# EAGLE design mainv1 (EAGLE 6.5.0)
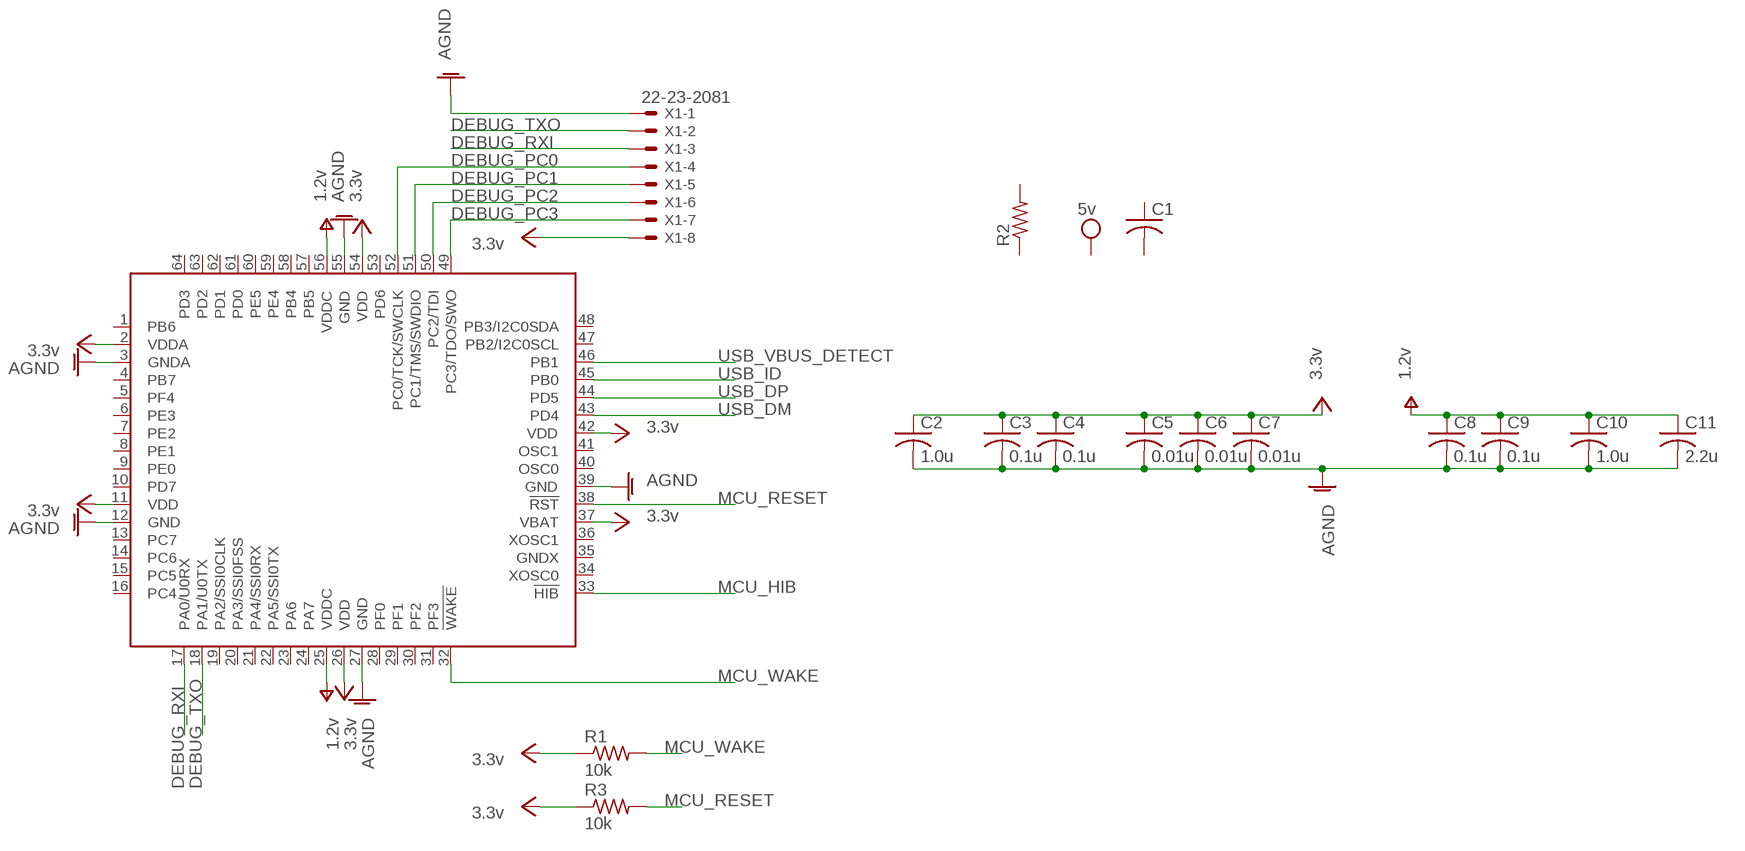
[diagram p0: schematic, sheet 1]

## Parts
C1  C-USC0805K  [C0805K]
C2  1.0u  C-USC0805K  [C0805K]
C3  0.1u  C-USC0805K  [C0805K]
C4  0.1u  C-USC0805K  [C0805K]
C5  0.01u  C-USC0805K  [C0805K]
C6  0.01u  C-USC0805K  [C0805K]
C7  0.01u  C-USC0805K  [C0805K]
C8  0.1u  C-USC0805K  [C0805K]
C9  0.1u  C-USC0805K  [C0805K]
C10  1.0u  C-USC0805K  [C0805K]
C11  2.2u  C-USC0805K  [C0805K]
IC1  TM4C123GH6PMI  [PM_S-PQFP-G64]
R1  10k  R-US_R0805  [R0805]
R2  R-US_R0805  [R0805]
R3  10k  R-US_R0805  [R0805]
X1  22-23-2081  [22-23-2081]

## Nets
AGND: C2.2 C3.2 C4.2 C5.2 C6.2 C7.2 C8.2 C9.2 C10.2 C11.2 IC1.3(GNDA) IC1.12(GND) IC1.27(GND) IC1.39(GND) IC1.55(GND) X1.1
DEBUG_PC0: IC1.52(PC0/TCK/SWCLK) X1.4
DEBUG_PC1: IC1.51(PC1/TMS/SWDIO) X1.5
DEBUG_PC2: IC1.50(PC2/TDI) X1.6
DEBUG_PC3: IC1.49(PC3/TDO/SWO) X1.7
DEBUG_RXI: IC1.17(PA0/U0RX) X1.3
DEBUG_TXO: IC1.18(PA1/U0TX) X1.2
MCU_HIB: IC1.33(!HIB)
MCU_RESET: IC1.38(!RST) R3.2
MCU_WAKE: IC1.32(!WAKE) R1.2
USB_DM: IC1.43(PD4)
USB_DP: IC1.44(PD5)
USB_ID: IC1.45(PB0)
USB_VBUS_DETECT: IC1.46(PB1)
V+: C8.1 C9.1 C10.1 C11.1 IC1.25(VDDC) IC1.56(VDDC) ; supply symbol labelled 1.2v
VCC: C2.1 C3.1 C4.1 C5.1 C6.1 C7.1 IC1.2(VDDA) IC1.11(VDD) IC1.26(VDD) IC1.37(VBAT) IC1.42(VDD) IC1.54(VDD) R1.1 R3.1 X1.8 ; supply symbol labelled 3.3v
Unconnected: C1.1 C1.2 IC1.1(PB6) IC1.4(PB7) IC1.5(PF4) IC1.6(PE3) IC1.7(PE2) IC1.8(PE1) IC1.9(PE0) IC1.10(PD7) IC1.13(PC7) IC1.14(PC6) IC1.15(PC5) IC1.16(PC4) IC1.19(PA2/SSI0CLK) IC1.20(PA3/SSI0FSS) IC1.21(PA4/SSI0RX) IC1.22(PA5/SSI0TX) IC1.23(PA6) IC1.24(PA7) IC1.28(PF0) IC1.29(PF1) IC1.30(PF2) IC1.31(PF3) IC1.34(XOSC0) IC1.35(GNDX) IC1.36(XOSC1) IC1.40(OSC0) IC1.41(OSC1) IC1.47(PB2/I2C0SCL) IC1.48(PB3/I2C0SDA) IC1.53(PD6) IC1.57(PB5) IC1.58(PB4) IC1.59(PE4) IC1.60(PE5) IC1.61(PD0) IC1.62(PD1) IC1.63(PD2) IC1.64(PD3) R2.1 R2.2

## Library data of the parts
C1-C11 = rcl:C-US: CAPACITOR, American symbol
IC1 = ti-tiva:TM4C123GH6PMI: by AtillaB
R1-R3 = rcl:R-US_: RESISTOR, American symbol
X1 = con-molex:22-23-2081: .100" (2.54mm) Center Header - 8 Pin; MF: MOLEX; MPN: 22-23-2081; OC_FARNELL: 1756826; OC_NEWARK: 01C7592

## Board
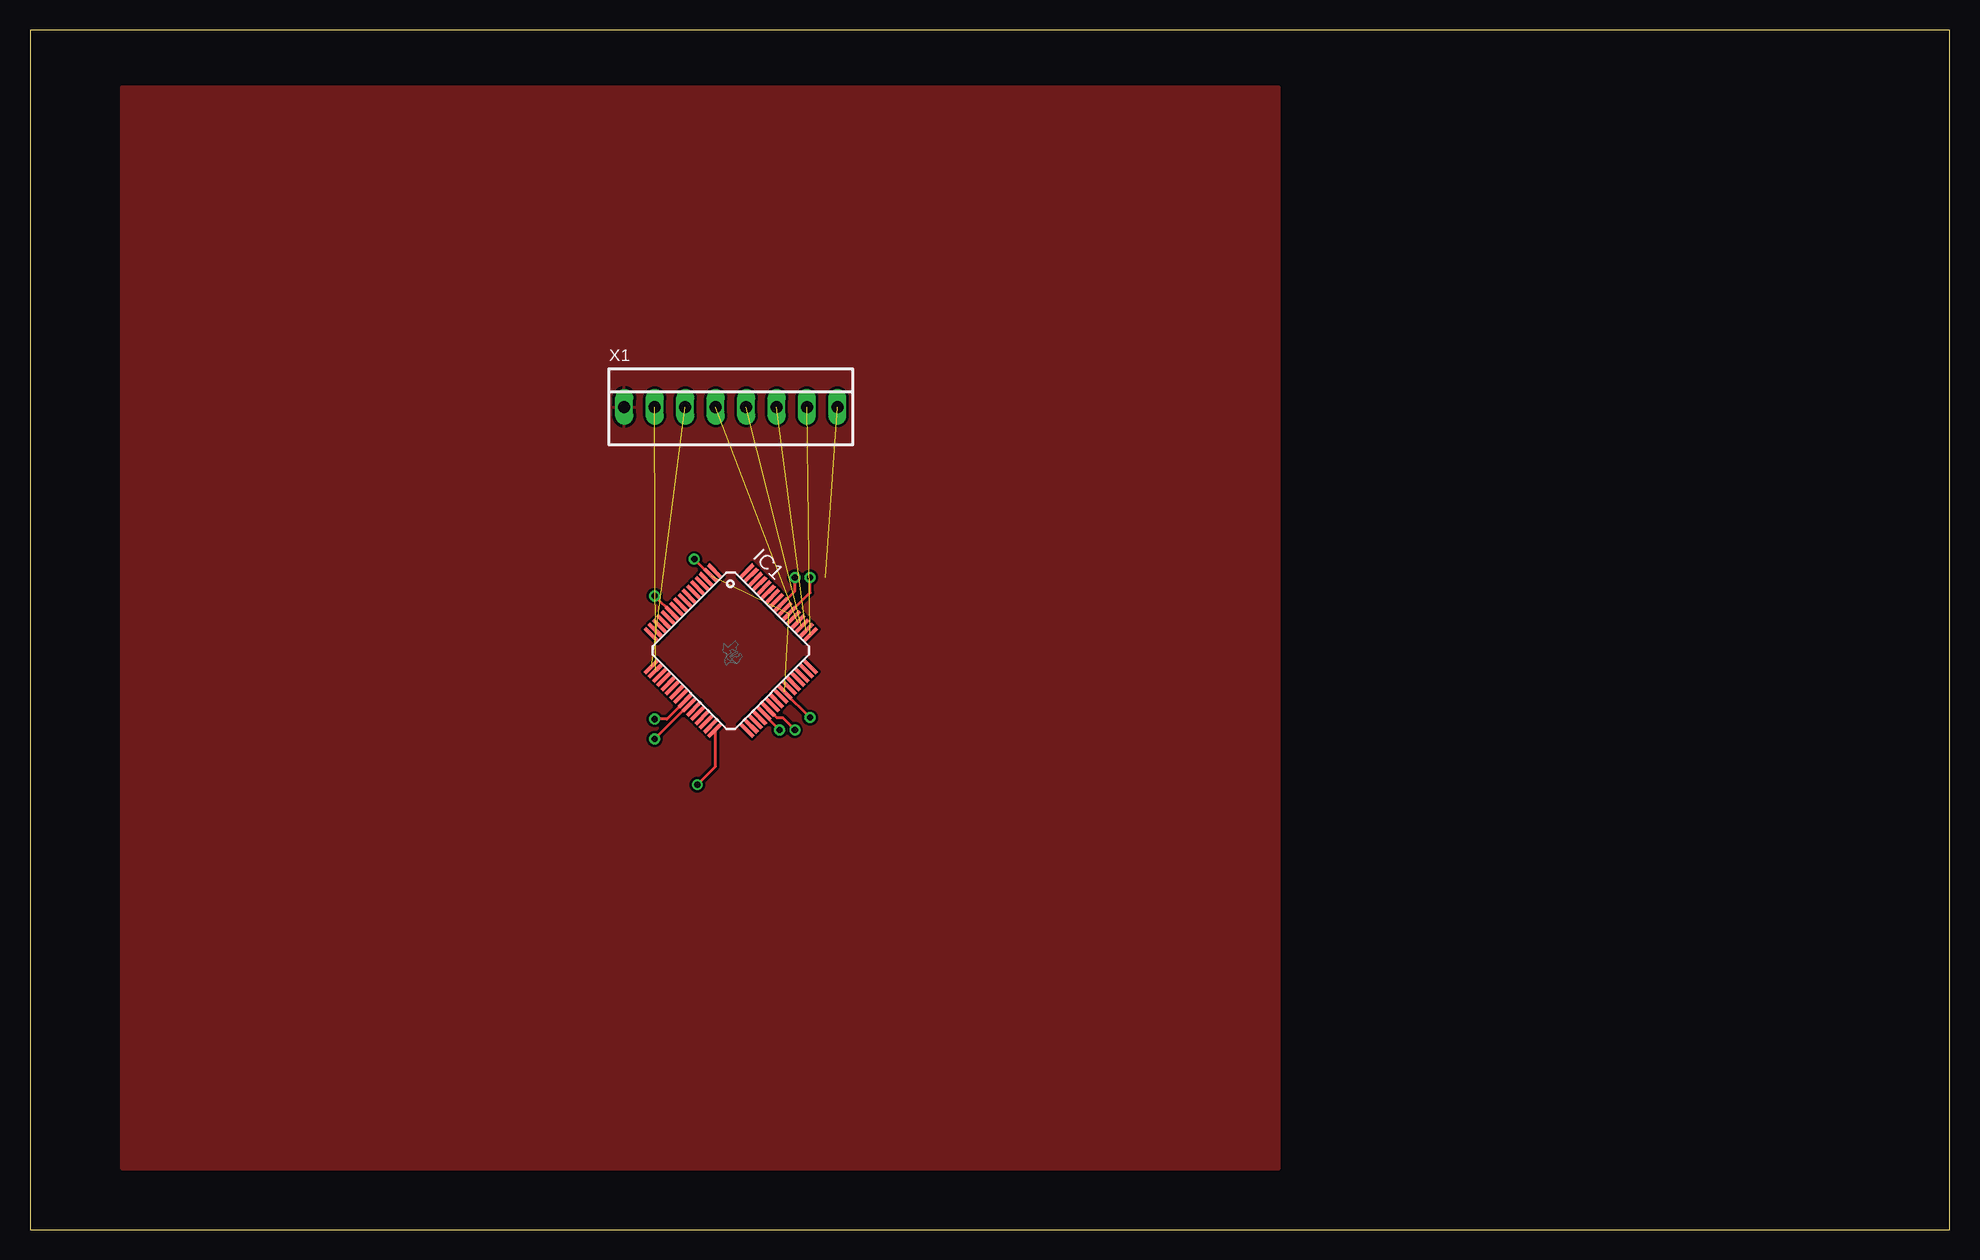
[diagram p1: board, top side]
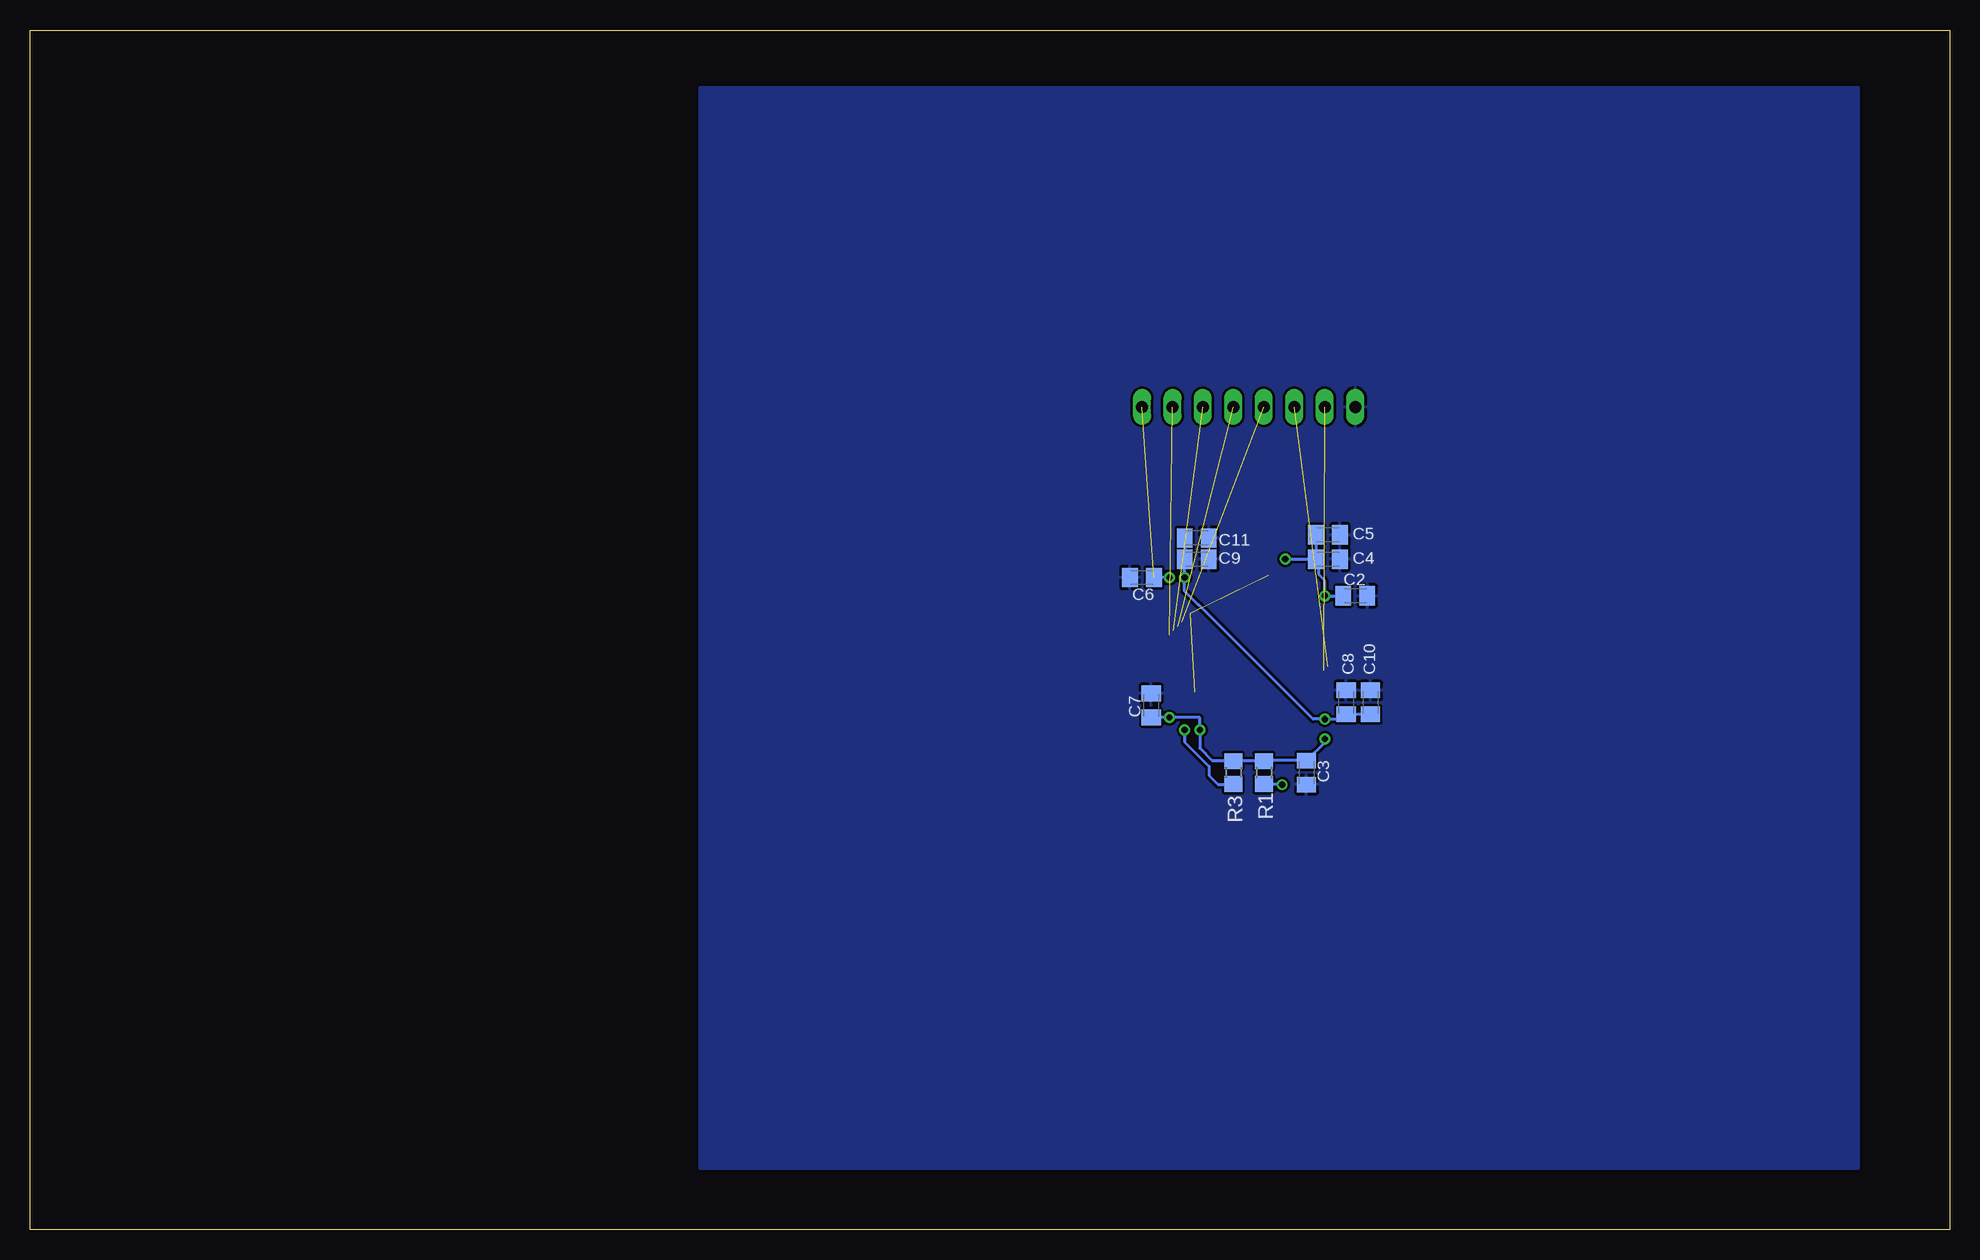
[diagram p2: board, bottom side, seen from below]

Size 160 x 100 mm. Coordinates in mm from the lower left corner, seen from the top.
Outline: 0,0 160,0 160,100 0,100 0,0
Copper layers (1*16): Top 0.035mm / dielectric 1.5mm / Bottom 0.035mm
Design rules "default": minimum track width 10mil, minimum drill 24mil, track to track 8mil, track to pad 8mil, pad to pad 8mil, via to via 8mil, smd to smd 8mil, copper to edge 40mil, drill to drill 8mil, minimum pad ring 10mil, minimum via ring 8mil, stop-mask expansion 4mil, vias tented up to drill 0mil, thermal gap 10mil

### Footprints (pad centres in the part's own frame; a part is rotated, then mirrored left to right if it is on the bottom)
C0805K = smd 1.3 x 1.6: 1 -1,0; 2 1,0
PM_S-PQFP-G64 = smd 1.6 x 0.3: 1 -5.6,3.75; 2 -5.6,3.25; 3 -5.6,2.75; 4 -5.6,2.25; 5 -5.6,1.75; 6 -5.6,1.25; 7 -5.6,0.75; 8 -5.6,0.25; 9 -5.6,-0.25; 10 -5.6,-0.75; 11 -5.6,-1.25; 12 -5.6,-1.75; 13 -5.6,-2.25; 14 -5.6,-2.75; 15 -5.6,-3.25; 16 -5.6,-3.75; 33 5.6,-3.75; 34 5.6,-3.25; 35 5.6,-2.75; 36 5.6,-2.25; 37 5.6,-1.75; 38 5.6,-1.25; 39 5.6,-0.75; 40 5.6,-0.25; 41 5.6,0.25; 42 5.6,0.75; 43 5.6,1.25; 44 5.6,1.75; 45 5.6,2.25; 46 5.6,2.75; 47 5.6,3.25; 48 5.6,3.75 | smd 0.3 x 1.6: 17 -3.75,-5.6; 18 -3.25,-5.6; 19 -2.75,-5.6; 20 -2.25,-5.6; 21 -1.75,-5.6; 22 -1.25,-5.6; 23 -0.75,-5.6; 24 -0.25,-5.6; 25 0.25,-5.6; 26 0.75,-5.6; 27 1.25,-5.6; 28 1.75,-5.6; 29 2.25,-5.6; 30 2.75,-5.6; 31 3.25,-5.6; 32 3.75,-5.6; 49 3.75,5.6; 50 3.25,5.6; 51 2.75,5.6; 52 2.25,5.6; 53 1.75,5.6; 54 1.25,5.6; 55 0.75,5.6; 56 0.25,5.6; 57 -0.25,5.6; 58 -0.75,5.6; 59 -1.25,5.6; 60 -1.75,5.6; 61 -2.25,5.6; 62 -2.75,5.6; 63 -3.25,5.6; 64 -3.75,5.6
R0805 = smd 1.3 x 1.5: 1 -0.95,0; 2 0.95,0
22-23-2081 = drill 1 long: 1 -8.89,0; 2 -6.35,0; 3 -3.81,0; 4 -1.27,0; 5 1.27,0; 6 3.81,0; 7 6.35,0; 8 8.89,0

### Placement (x,y rotation side)
C1  -39.37,24.13 0 top  (outside the outline)
C2  49.53,52.83 0 bottom
C3  53.59,38.1 270 bottom
C4  51.82,55.88 0 bottom
C5  51.82,57.91 0 bottom
C6  67.31,54.36 180 bottom
C7  66.55,43.69 90 bottom
C8  50.29,43.94 90 bottom
C9  62.74,55.88 0 bottom
C10  48.26,43.94 90 bottom
C11  62.74,57.66 0 bottom
IC1  58.42,48.26 315 top
R1  57.15,38.1 270 bottom
R2  -39.37,27.94 0 top  (outside the outline)
R3  59.69,38.1 270 bottom
X1  58.42,68.58 0 top

### Tracks (layer width: path | path; a pad name or v marks a point on that pad's centre or on a via)
AGND
  pour Top: 7.62,95.25 7.62,5.08 104.14,5.08 104.14,95.25
  pour Bottom: 7.62,93.98 7.62,5.08 104.14,5.08 104.14,95.25 7.62,95.25
DEBUG_PC0  (1 unrouted)
DEBUG_PC1  (1 unrouted)
DEBUG_PC2  (1 unrouted)
DEBUG_PC3  (1 unrouted)
DEBUG_RXI  (1 unrouted)
DEBUG_TXO  (1 unrouted)
MCU_RESET  (via drill 0.51)
  Top 0.254: IC1.38 61.5,43.41 62.23,42.67 62.74,42.67 v63.75,41.66
  Bottom 0.254: v63.75,41.66 63.75,40.64 61.72,38.61 61.72,37.85 60.96,37.08 59.76,37.08 R3.2
MCU_WAKE  (via drill 0.51)
  Top 0.254: IC1.32 57.11,38.57 v55.63,37.08
  Bottom 0.254: v55.63,37.08 57.08,37.08 R1.2
V+  (via drill 0.51)
  Top 0.254: IC1.56 62.58,52.04 63.75,53.21 v63.75,54.36 | IC1.25 54.64,44.1 53.09,42.55 v52.07,42.55
  Bottom 0.254: C11.1 C9.1 63.75,54.88 v63.75,54.36 63.75,53.21 62.58,52.04 IC1.56 53.06,42.55 v52.07,42.55 50.69,42.55 C8.1 C10.1
VCC  (via drill 0.51)  (3 unrouted)
  Top 0.254: IC1.54 63.27,51.34 65.02,53.09 v65.02,54.36 | IC1.42 62.91,44.79 v65.02,42.67 | IC1.37 61.14,43 v62.48,41.66 | IC1.26 54.95,43.77 v52.07,40.89 | IC1.2 56.73,54.52 v55.37,55.88 | IC1.11 53.57,51.34 v52.07,52.83
  Bottom 0.254: v65.02,54.36 C6.1 | C7.1 66.53,42.67 v65.02,42.67 62.48,42.67 v62.48,41.66 62.48,40.13 61.47,39.12 59.76,39.12 R3.1 R1.1 57.1,39.1 C3.1 52.07,40.62 v52.07,40.89 | C5.1 C4.1 | v55.37,55.88 C4.1 | C2.1 v52.07,52.83 52.07,54.1 52.58,54.61 52.58,55.64 C4.1